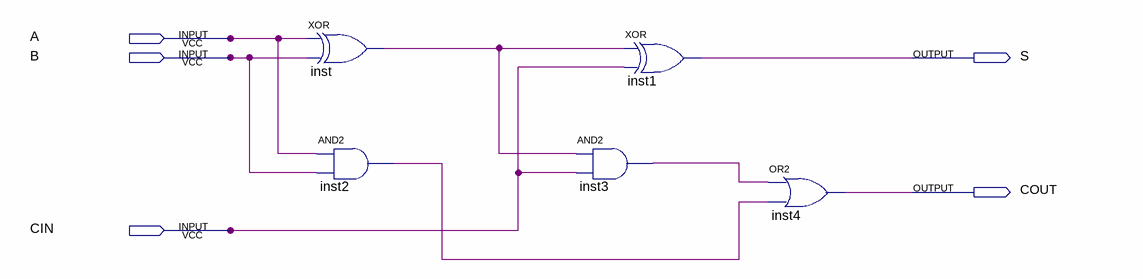
[diagram p0: schematic sheet]
// Quartus schematic sumador2b.bdf as structural Verilog: 5 symbols, 5 pins
module sumador2b (
  input  A,
  input  B,
  input  CIN,
  output S,
  output COUT
);

  wire inst2_out, inst3_out, inst_out;

  xor inst (inst_out, A, B);
  and inst2 (inst2_out, A, B);
  xor inst1 (S, inst_out, CIN);
  and inst3 (inst3_out, inst_out, CIN);
  or inst4 (COUT, inst3_out, inst2_out);
endmodule
